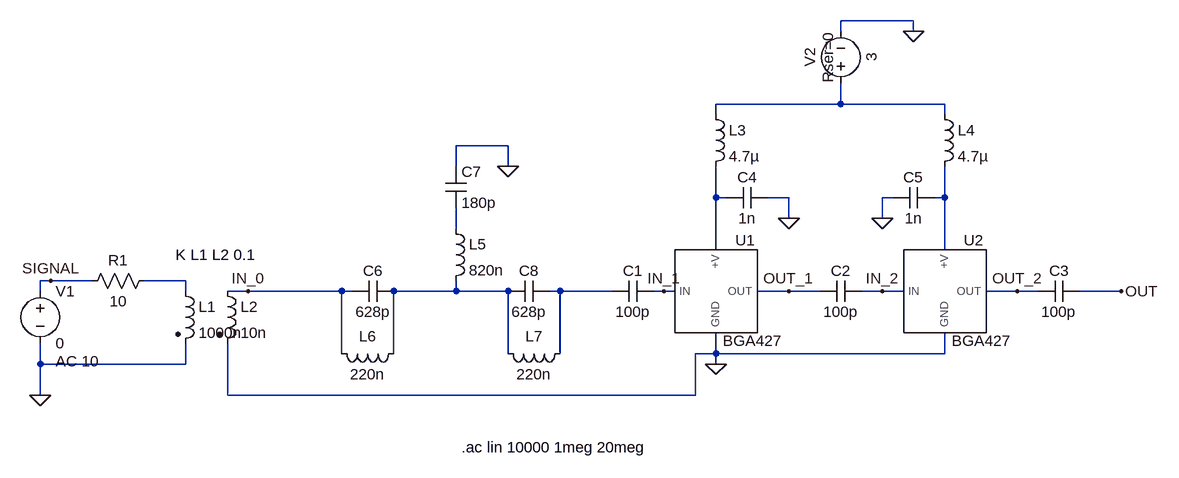
[diagram p0: schematic bga427_test.asc]
bga427_test.asc, the LTspice schematic file:
Version 4
SHEET 1 1004 680
WIRE 608 -256 496 -256
WIRE 496 -240 496 -256
WIRE 608 -240 608 -256
WIRE 496 -128 496 -160
WIRE 496 -128 304 -128
WIRE 656 -128 496 -128
WIRE 304 -112 304 -128
WIRE 656 -112 656 -128
WIRE -16 -64 -96 -64
WIRE -96 -32 -96 -64
WIRE -16 -32 -16 -64
WIRE 304 16 304 -32
WIRE 320 16 304 16
WIRE 416 16 384 16
WIRE 576 16 560 16
WIRE 656 16 656 -32
WIRE 656 16 640 16
WIRE 416 48 416 16
WIRE 560 48 560 16
WIRE -96 64 -96 32
WIRE 304 96 304 16
WIRE 656 96 656 16
WIRE -720 144 -736 144
WIRE -656 144 -720 144
WIRE -512 144 -576 144
WIRE -736 160 -736 144
WIRE -512 160 -512 144
WIRE -416 160 -448 160
WIRE -272 160 -416 160
WIRE -256 160 -272 160
WIRE -96 160 -96 144
WIRE -96 160 -192 160
WIRE -16 160 -96 160
WIRE 64 160 48 160
WIRE 144 160 64 160
WIRE 224 160 208 160
WIRE 240 160 224 160
WIRE 416 160 368 160
WIRE 464 160 416 160
WIRE 560 160 528 160
WIRE 592 160 560 160
WIRE 768 160 720 160
WIRE 800 160 768 160
WIRE 928 160 864 160
WIRE -272 256 -272 160
WIRE -192 256 -192 160
WIRE -16 256 -16 160
WIRE 64 256 64 160
WIRE 304 256 304 224
WIRE 304 256 272 256
WIRE 656 256 656 224
WIRE 656 256 304 256
WIRE -736 272 -736 240
WIRE -512 272 -512 240
WIRE -512 272 -736 272
WIRE 304 272 304 256
WIRE -736 320 -736 272
WIRE -448 320 -448 240
WIRE 272 320 272 256
WIRE 272 320 -448 320
FLAG 304 272 0
FLAG 608 -240 0
FLAG 928 160 OUT
FLAG -416 160 IN_0
FLAG 416 160 OUT_1
FLAG 560 160 IN_2
FLAG 224 160 IN_1
FLAG 768 160 OUT_2
FLAG -720 144 SIGNAL
FLAG -736 320 0
FLAG 416 48 0
FLAG 560 48 0
FLAG -16 -32 0
SYMBOL My_Symbols\\BGA427 304 160 R0
SYMATTR InstName U1
SYMBOL voltage -736 144 R0
WINDOW 123 24 124 Left 2
WINDOW 39 0 0 Left 2
SYMATTR Value2 AC 10
SYMATTR InstName V1
SYMATTR Value 0
SYMBOL voltage 496 -144 R180
WINDOW 0 32 56 VTop 2
WINDOW 3 -32 56 VBottom 2
WINDOW 123 0 0 Left 2
WINDOW 39 4 56 VTop 2
SYMATTR InstName V2
SYMATTR Value 3
SYMATTR SpiceLine Rser=0
SYMBOL cap 144 176 R270
WINDOW 0 32 32 VTop 2
WINDOW 3 0 32 VBottom 2
SYMATTR InstName C1
SYMATTR Value 100p
SYMBOL cap 464 176 R270
WINDOW 0 32 32 VTop 2
WINDOW 3 0 32 VBottom 2
SYMATTR InstName C2
SYMATTR Value 100p
SYMBOL My_Symbols\\BGA427 656 160 R0
SYMATTR InstName U2
SYMBOL cap 864 144 R90
WINDOW 0 0 32 VBottom 2
WINDOW 3 32 32 VTop 2
SYMATTR InstName C3
SYMATTR Value 100p
SYMBOL ind2 -528 144 R0
SYMATTR InstName L1
SYMATTR Value 1000n
SYMATTR Type ind
SYMBOL ind2 -464 144 R0
SYMATTR InstName L2
SYMATTR Value 10n
SYMATTR Type ind
SYMBOL res -672 160 R270
WINDOW 0 32 56 VTop 2
WINDOW 3 0 56 VBottom 2
SYMATTR InstName R1
SYMATTR Value 10
SYMBOL cap 384 0 R90
WINDOW 0 0 32 VBottom 2
WINDOW 3 32 32 VTop 2
SYMATTR InstName C4
SYMATTR Value 1n
SYMBOL cap 640 0 R90
WINDOW 0 0 32 VBottom 2
WINDOW 3 32 32 VTop 2
SYMATTR InstName C5
SYMATTR Value 1n
SYMBOL ind 288 -128 R0
SYMATTR InstName L3
SYMATTR Value 4.7µ
SYMBOL ind 640 -128 R0
SYMATTR InstName L4
SYMATTR Value 4.7µ
SYMBOL cap -192 144 R90
WINDOW 0 0 32 VBottom 2
WINDOW 3 32 32 VTop 2
SYMATTR InstName C6
SYMATTR Value 628p
SYMBOL cap -112 -32 R0
SYMATTR InstName C7
SYMATTR Value 180p
SYMBOL cap 48 144 R90
WINDOW 0 0 32 VBottom 2
WINDOW 3 32 32 VTop 2
SYMATTR InstName C8
SYMATTR Value 628p
SYMBOL ind -112 48 R0
SYMATTR InstName L5
SYMATTR Value 820n
SYMBOL ind -176 240 R90
WINDOW 0 5 56 VBottom 2
WINDOW 3 32 56 VTop 2
SYMATTR InstName L6
SYMATTR Value 220n
SYMBOL ind 80 240 R90
WINDOW 0 5 56 VBottom 2
WINDOW 3 32 56 VTop 2
SYMATTR InstName L7
SYMATTR Value 220n
TEXT -88 400 Left 2 !.ac lin 10000 1meg 20meg
TEXT -528 104 Left 2 !K L1 L2 0.1

The netlist it stands for:
* bga427_test.asc
XU1 IN_1 OUT_1 N002 0 BGA427  ; pins IN OUT +V GND
V1 SIGNAL 0 0 AC 10
V2 N001 0 3 Rser=0
C1 N007 IN_1 100p
C2 OUT_1 IN_2 100p
XU2 IN_2 OUT_2 N003 0 BGA427  ; pins IN OUT +V GND
C3 OUT OUT_2 100p
L1 N005 0 1000n
L2 IN_0 0 10n
R1 SIGNAL N005 10
C4 0 N002 1n
C5 N003 0 1n
L3 N001 N002 4.7µ
L4 N001 N003 4.7µ
C6 N006 IN_0 628p
C7 0 N004 180p
C8 N007 N006 628p
L5 N004 N006 820n
L6 N006 IN_0 220n
L7 N007 N006 220n
.ac lin 10000 1meg 20meg
K L1 L2 0.1
.lib bga427.sub
.backanno
.end